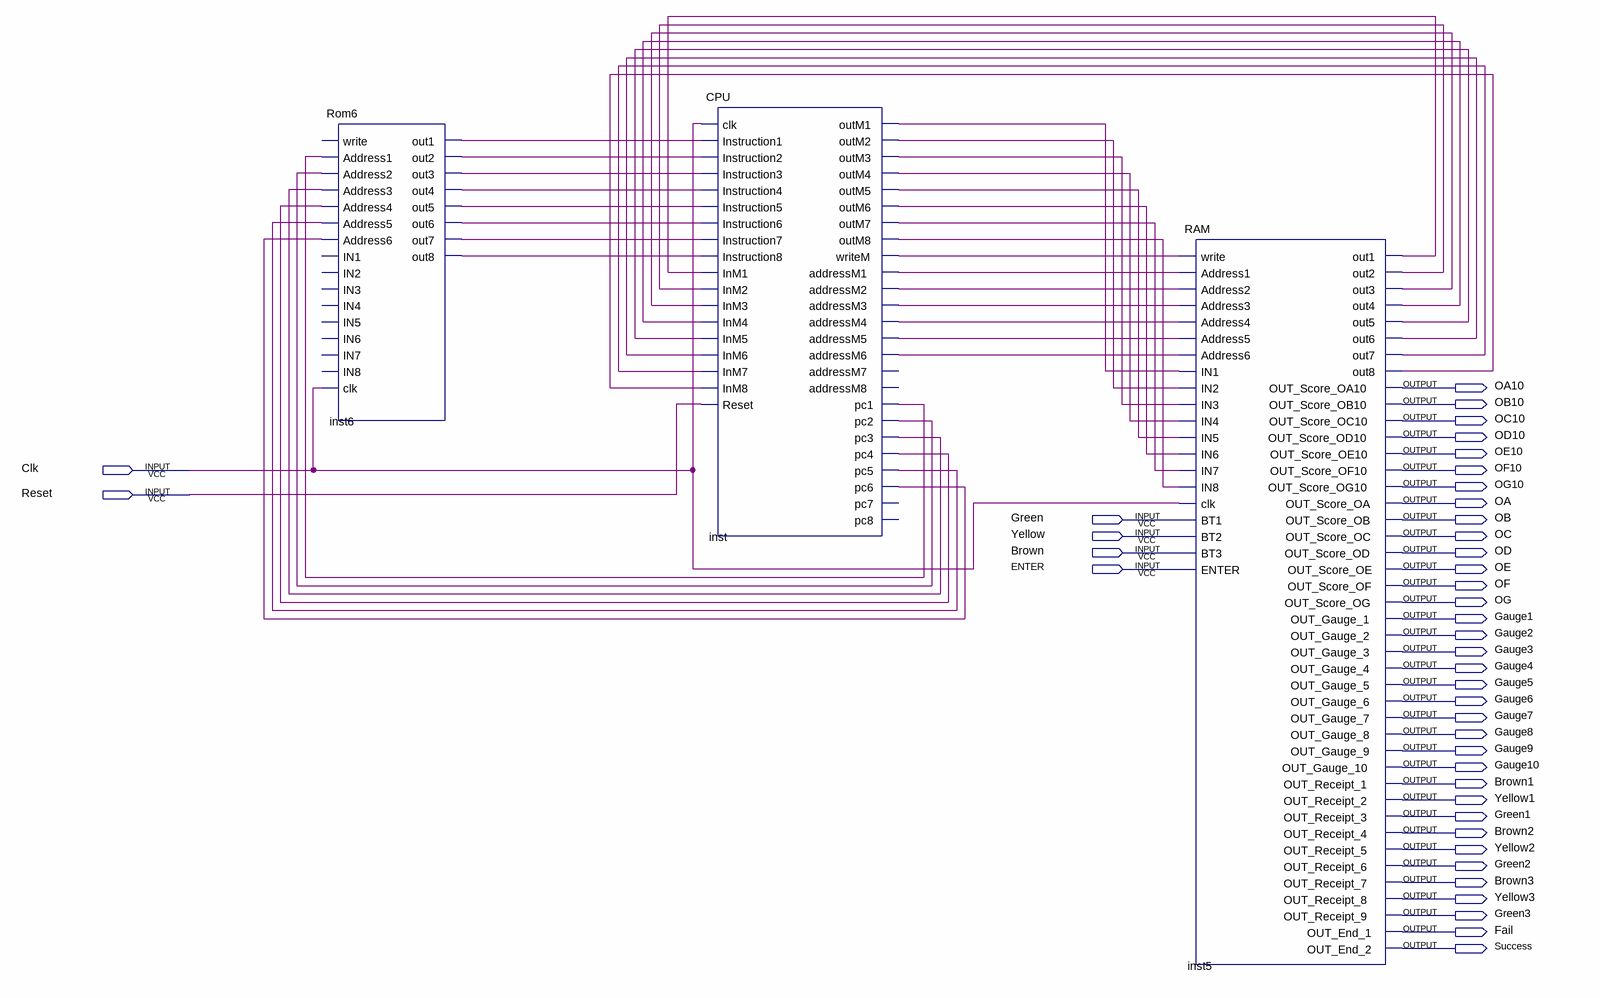
[diagram p0: schematic sheet]
// Quartus schematic computer.bdf as structural Verilog: 3 symbols, 41 pins
module computer (
  input  Clk,
  input  Reset,
  input  Green,
  input  Yellow,
  input  Brown,
  input  ENTER,
  output OA10,
  output OB10,
  output OC10,
  output OD10,
  output OE10,
  output OF10,
  output OG10,
  output OA,
  output OB,
  output OC,
  output OD,
  output OE,
  output OF,
  output OG,
  output Gauge1,
  output Gauge2,
  output Gauge3,
  output Gauge4,
  output Gauge5,
  output Gauge6,
  output Gauge7,
  output Gauge8,
  output Gauge9,
  output Gauge10,
  output Brown1,
  output Yellow1,
  output Green1,
  output Brown2,
  output Yellow2,
  output Green2,
  output Brown3,
  output Yellow3,
  output Green3,
  output Fail,
  output Success
);

  wire inst5_out1, inst5_out2, inst5_out3, inst5_out4, inst5_out5, inst5_out6, inst5_out7, inst5_out8,
       inst6_out1, inst6_out2, inst6_out3, inst6_out4, inst6_out5, inst6_out6, inst6_out7, inst6_out8,
       inst_addressm1, inst_addressm2, inst_addressm3, inst_addressm4, inst_addressm5, inst_addressm6,
       inst_outm1, inst_outm2, inst_outm3, inst_outm4, inst_outm5, inst_outm6, inst_outm7, inst_outm8,
       inst_pc1, inst_pc2, inst_pc3, inst_pc4, inst_pc5, inst_pc6, inst_writem;

  Rom6 inst6 (
    .Address1(inst_pc1), .Address2(inst_pc2), .Address3(inst_pc3), .Address4(inst_pc4), .Address5(inst_pc5),
    .Address6(inst_pc6), .clk(Clk), .out1(inst6_out1), .out2(inst6_out2), .out3(inst6_out3),
    .out4(inst6_out4), .out5(inst6_out5), .out6(inst6_out6), .out7(inst6_out7), .out8(inst6_out8));  // open: write, IN1, IN2, IN3, IN4, IN5, IN6, IN7, IN8
  CPU inst (
    .clk(Clk), .Instruction1(inst6_out1), .Instruction2(inst6_out2), .Instruction3(inst6_out3),
    .Instruction4(inst6_out4), .Instruction5(inst6_out5), .Instruction6(inst6_out6),
    .Instruction7(inst6_out7), .Instruction8(inst6_out8), .InM1(inst5_out1), .InM2(inst5_out2),
    .InM3(inst5_out3), .InM4(inst5_out4), .InM5(inst5_out5), .InM6(inst5_out6), .InM7(inst5_out7),
    .InM8(inst5_out8), .Reset(Reset), .outM1(inst_outm1), .outM2(inst_outm2), .outM3(inst_outm3),
    .outM4(inst_outm4), .outM5(inst_outm5), .outM6(inst_outm6), .outM7(inst_outm7), .outM8(inst_outm8),
    .writeM(inst_writem), .addressM1(inst_addressm1), .addressM2(inst_addressm2), .addressM3(inst_addressm3),
    .addressM4(inst_addressm4), .addressM5(inst_addressm5), .addressM6(inst_addressm6), .pc1(inst_pc1),
    .pc2(inst_pc2), .pc3(inst_pc3), .pc4(inst_pc4), .pc5(inst_pc5), .pc6(inst_pc6));  // open: addressM7, addressM8, pc7, pc8
  RAM inst5 (
    .write(inst_writem), .Address1(inst_addressm1), .Address2(inst_addressm2), .Address3(inst_addressm3),
    .Address4(inst_addressm4), .Address5(inst_addressm5), .Address6(inst_addressm6), .IN1(inst_outm1),
    .IN2(inst_outm2), .IN3(inst_outm3), .IN4(inst_outm4), .IN5(inst_outm5), .IN6(inst_outm6),
    .IN7(inst_outm7), .IN8(inst_outm8), .clk(Clk), .BT1(Green), .BT2(Yellow), .BT3(Brown), .ENTER(ENTER),
    .out1(inst5_out1), .out2(inst5_out2), .out3(inst5_out3), .out4(inst5_out4), .out5(inst5_out5),
    .out6(inst5_out6), .out7(inst5_out7), .out8(inst5_out8), .OUT_Score_OA10(OA10), .OUT_Score_OB10(OB10),
    .OUT_Score_OC10(OC10), .OUT_Score_OD10(OD10), .OUT_Score_OE10(OE10), .OUT_Score_OF10(OF10),
    .OUT_Score_OG10(OG10), .OUT_Score_OA(OA), .OUT_Score_OB(OB), .OUT_Score_OC(OC), .OUT_Score_OD(OD),
    .OUT_Score_OE(OE), .OUT_Score_OF(OF), .OUT_Score_OG(OG), .OUT_Gauge_1(Gauge1), .OUT_Gauge_2(Gauge2),
    .OUT_Gauge_3(Gauge3), .OUT_Gauge_4(Gauge4), .OUT_Gauge_5(Gauge5), .OUT_Gauge_6(Gauge6),
    .OUT_Gauge_7(Gauge7), .OUT_Gauge_8(Gauge8), .OUT_Gauge_9(Gauge9), .OUT_Gauge_10(Gauge10),
    .OUT_Receipt_1(Brown1), .OUT_Receipt_2(Yellow1), .OUT_Receipt_3(Green1), .OUT_Receipt_4(Brown2),
    .OUT_Receipt_5(Yellow2), .OUT_Receipt_6(Green2), .OUT_Receipt_7(Brown3), .OUT_Receipt_8(Yellow3),
    .OUT_Receipt_9(Green3), .OUT_End_1(Fail), .OUT_End_2(Success));
endmodule
